# EAGLE design stepper (EAGLE 6.5.0)
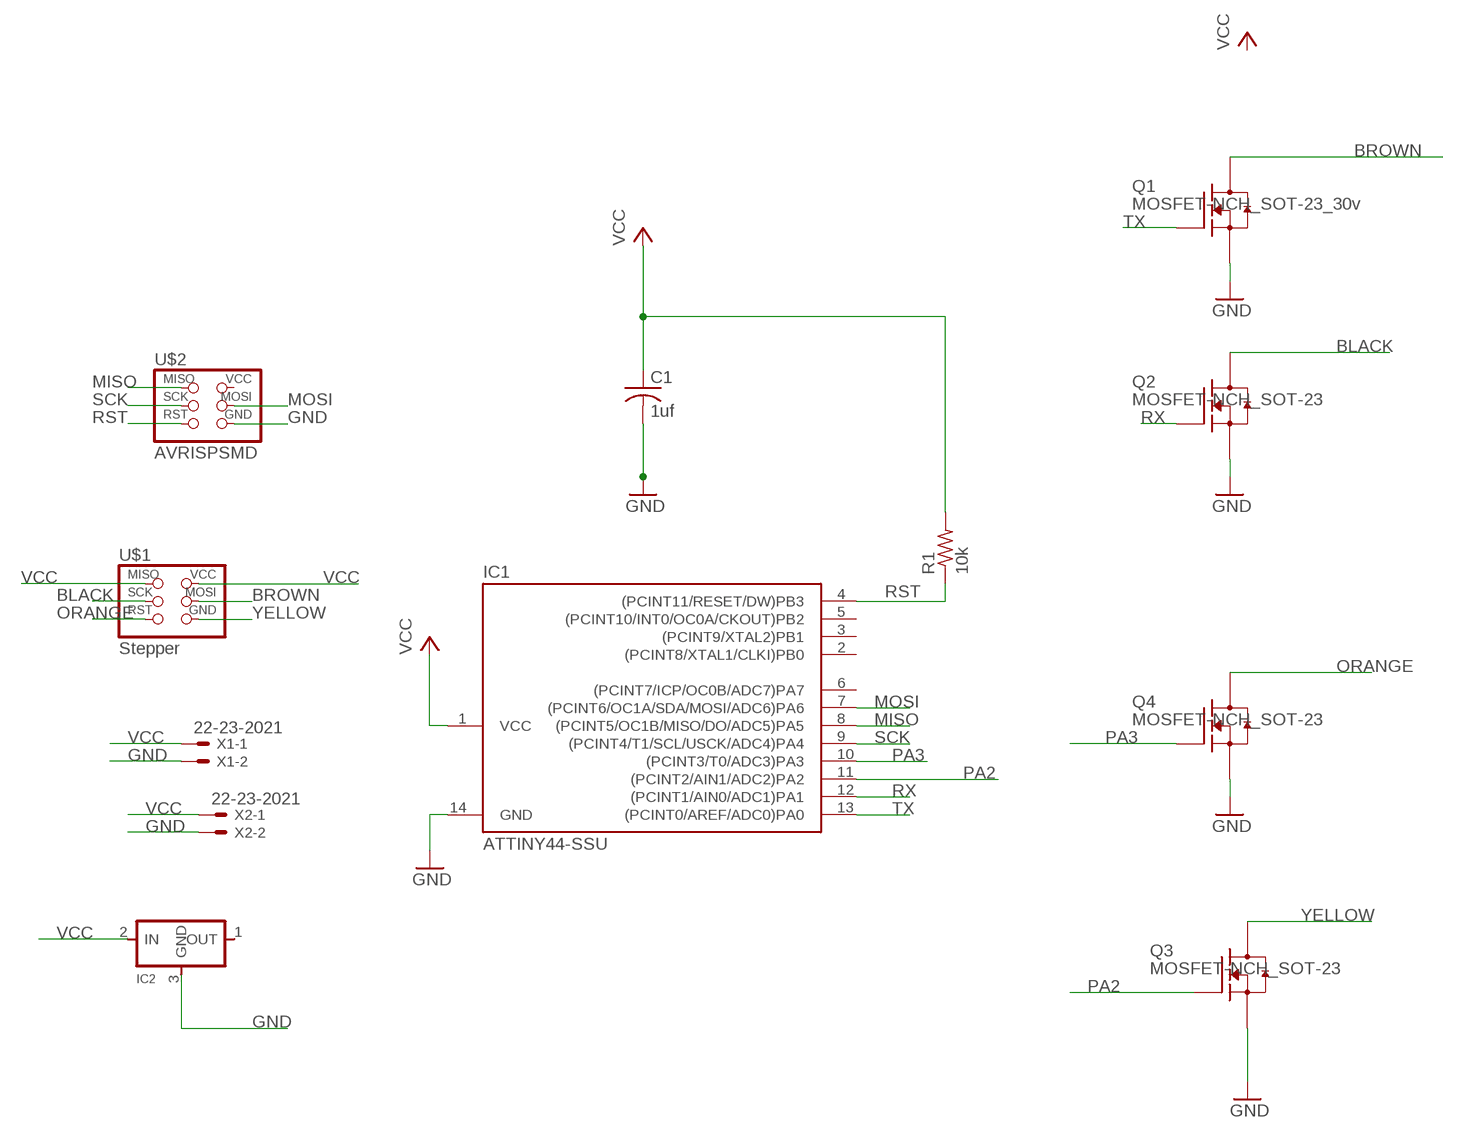
[diagram p0: schematic, sheet 1]

## Parts
C1  1uf  C-USC1206  [C1206]
IC1  ATTINY44-SSU  [SOIC14]
IC2  REGULATORSOT23  [SOT23]
Q1  MOSFET-NCH_SOT-23_30v  MOSFET-NCH_SOT-23  [SOT95P280X135-3N]
Q2  MOSFET-NCH_SOT-23  [SOT95P280X135-3N]
Q3  MOSFET-NCH_SOT-23  [SOT95P280X135-3N]
Q4  MOSFET-NCH_SOT-23  [SOT95P280X135-3N]
R1  10k  R-US_R1206  [R1206]
U$1  Stepper  AVRISPSMD  [2X03SMD]
U$2  AVRISPSMD  [2X03SMD]
X1  22-23-2021  [22-23-2021]
X2  22-23-2021  [22-23-2021]

## Nets
BLACK: Q2.3(D) U$1.3(SCK)
BROWN: Q1.3(D) U$1.4(MOSI)
GND: C1.2 IC1.14(GND) IC2.3(GND) Q1.2(S) Q2.2(S) Q3.2(S) Q4.2(S) U$2.6(GND) X1.2 X2.2
MISO: IC1.8((PCINT5/OC1B/MISO/DO/ADC5)PA5) U$2.1(MISO)
MOSI: IC1.7((PCINT6/OC1A/SDA/MOSI/ADC6)PA6) U$2.4(MOSI)
ORANGE: Q4.3(D) U$1.5(RST)
OUT: C1.1 R1.2 ; supply symbol labelled VCC
PA2: IC1.11((PCINT2/AIN1/ADC2)PA2) Q3.1(G)
PA3: IC1.10((PCINT3/T0/ADC3)PA3) Q4.1(G)
RST: IC1.4((PCINT11/RESET/DW)PB3) R1.1 U$2.5(RST)
RX: IC1.12((PCINT1/AIN0/ADC1)PA1) Q2.1(G)
SCK: IC1.9((PCINT4/T1/SCL/USCK/ADC4)PA4) U$2.3(SCK)
TX: IC1.13((PCINT0/AREF/ADC0)PA0) Q1.1(G)
VCC: IC1.1(VCC) IC2.2(IN) U$1.1(MISO) U$1.2(VCC) X1.1 X2.1
YELLOW: Q3.3(D) U$1.6(GND)
Unconnected: IC1.2((PCINT8/XTAL1/CLKI)PB0) IC1.3((PCINT9/XTAL2)PB1) IC1.5((PCINT10/INT0/OC0A/CKOUT)PB2) IC1.6((PCINT7/ICP/OC0B/ADC7)PA7) IC2.1(OUT) U$2.2(VCC)

## Library data of the parts
C1 = rcl:C-US: CAPACITOR, American symbol
IC1 = fab:ATTINY44
IC2 = ng:REGULATOR
Q1-Q4 = fairchild_ipc-7351-transistor:MOSFET-NCH_
R1 = resistor:R-US_: RESISTOR, American symbol
U$1 U$2 = fab:AVRISP
X1 X2 = con-molex:22-23-2021: .100" (2.54mm) Center Header - 2 Pin; MF: MOLEX; MPN: 22-23-2021; OC_FARNELL: 1462926; OC_NEWARK: 25C3832

## Board
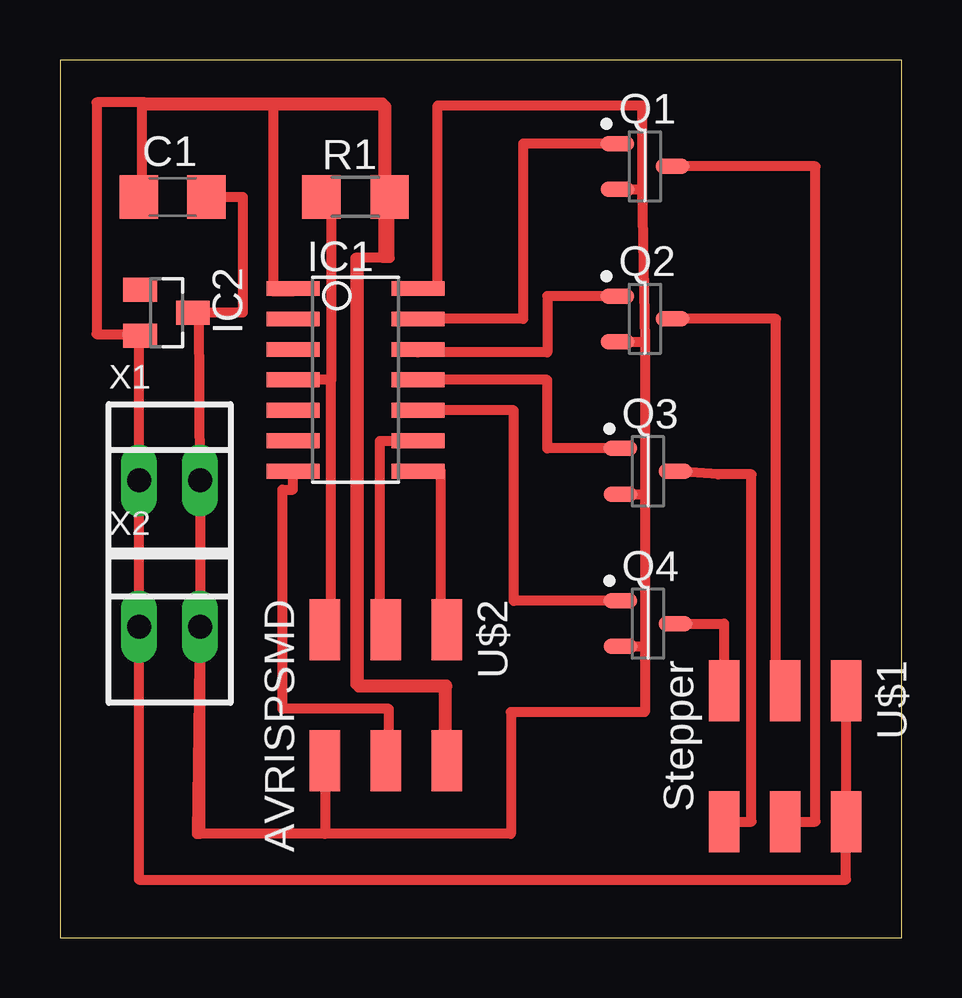
[diagram p1: board, top side]

Size 35.1 x 36.57 mm. Coordinates in mm from the lower left corner, seen from the top.
Outline: 0,0 35.1,0 35.1,36.57 0,36.57 0,0
Copper layers (1*16): Top 0.035mm / dielectric 1.5mm / Bottom 0.035mm
Design rules "default": minimum track width 10mil, minimum drill 24mil, track to track 8mil, track to pad 8mil, pad to pad 8mil, via to via 8mil, smd to smd 8mil, copper to edge 40mil, drill to drill 8mil, minimum pad ring 10mil, minimum via ring 8mil, stop-mask expansion 4mil, vias tented up to drill 0mil, thermal gap 10mil

### Footprints (pad centres in the part's own frame; a part is rotated, then mirrored left to right if it is on the bottom)
C1206 = smd 1.6 x 1.8: 1 -1.4,0; 2 1.4,0
SOIC14 = smd 0.61 x 2.21: 1 -3.81,-2.603; 2 -2.54,-2.603; 3 -1.27,-2.603; 4 0,-2.603; 5 1.27,-2.603; 6 2.54,-2.603; 7 3.81,-2.603; 8 3.81,2.603; 9 2.54,2.603; 10 1.27,2.603; 11 0,2.603; 12 -1.27,2.603; 13 -2.54,2.603; 14 -3.81,2.603
SOT23 = smd 1 x 1.4: 1 -0.95,-1.1; 2 0.95,-1.1; 3 0,1.1
SOT95P280X135-3N = smd 1.4 x 0.65: 1 -1.15,0.95; 2 -1.15,-0.95; 3 1.15,0
R1206 = smd 1.6 x 1.803: 1 -1.422,0; 2 1.422,0
2X03SMD = smd 2.54 x 1.27: 1 -2.54,2.54; 2 2.92,2.54; 3 -2.54,0; 4 2.92,0; 5 -2.54,-2.54; 6 2.92,-2.54
22-23-2021 = drill 1 long: 1 -1.27,0; 2 1.27,0

### Placement (x,y rotation side)
C1  4.7,30.86 0 top
IC1  12.32,23.24 270 top
IC2  4.45,26.04 270 top
Q1  24.38,32.13 0 top
Q2  24.38,25.78 0 top
Q3  24.51,19.43 0 top
Q4  24.51,13.08 0 top
R1  12.32,30.86 0 top
U$1  30.23,7.75 270 top
U$2  13.59,10.29 270 top
X1  4.57,19.05 0 top
X2  4.57,12.95 0 top

### Tracks (layer width: path | path; a pad name or v marks a point on that pad's centre or on a via)
BLACK
  Top 0.406: U$1.3 29.84,9.53 29.84,25.78 Q2.3
BROWN
  Top 0.406: U$1.4 31.5,4.83 31.5,32.13 Q1.3
GND
  Top 0.406: IC1.14 15.75,27.05 15.75,34.67 24.26,34.67 24.26,31.18 | 24.26,31.18 24.38,24.83 | 24.38,24.83 24.38,18.48 | 24.38,18.48 24.38,12.13 | 24.38,12.13 24.38,9.4 18.8,9.4 18.8,4.32 11.05,4.32 | Q1.2 24.26,31.18 | Q2.2 24.38,24.83 | Q4.2 24.38,12.13 | Q3.2 24.38,18.48 | 5.8,26.04 X1.2 5.84,4.32 | U$2.6 11.05,4.32 | 11.05,4.32 5.84,4.32 | 5.84,4.32 5.71,4.32 X2.2 | C1.2 7.62,30.86 7.62,26.04 5.8,26.04 | 5.8,26.04 IC2.3
MISO
  Top 0.406: U$2.1 15.88,13.08 15.88,19.43 IC1.8
MOSI
  Top 0.406: U$2.4 13.72,7.62 13.72,9.53 9.27,9.53 9.27,18.67 9.71,18.67 IC1.7
ORANGE
  Top 0.406: Q4.3 27.69,13.08 U$1.5
OUT
  Top 0.406: 13.59,28.32 13.59,34.67 3.43,34.67 3.43,30.86 C1.1 3.34,30.86 | 13.59,28.32 12.32,28.32 12.32,10.79 | 12.32,10.79 12.32,10.54 16.13,10.54 16.13,10.41 | 16.13,6.73 16.13,10.41 | 16.13,10.41 12.45,10.41 12.45,10.79 12.32,10.79 | 13.59,28.32 13.74,28.32 R1.2
PA2
  Top 0.406: IC1.11 20.32,23.24 20.32,20.38 Q3.1
PA3
  Top 0.406: Q4.1 18.92,14.03 18.92,21.97 IC1.10
RST
  Top 0.406: 11.3,23.24 IC1.4 | U$2.5 11.3,13.08 11.3,23.24 | R1.1 11.3,30.86 11.3,23.24
RX
  Top 0.406: Q2.1 20.32,26.73 20.32,24.38 14.92,24.38 IC1.12
SCK
  Top 0.406: U$2.3 13.34,13.08 13.34,20.7 IC1.9
TX
  Top 0.406: Q1.1 19.3,33.08 19.3,25.78 IC1.13
VCC
  Top 0.406: 32.77,7.11 U$1.1 U$1.2 32.77,2.41 3.3,2.41 X2.1 | X2.1 3.3,25.02 3.34,25.15 | 16,7.62 16,10.54 | 16,10.54 12.45,10.54 | 12.45,10.54 12.32,10.54 12.32,28.32 12.45,28.32 | 13.72,28.32 13.46,28.32 | 3.56,34.8 8.89,34.8 | 8.89,34.8 8.89,26.92 9.71,26.92 IC1.1 | 8.89,34.8 13.46,34.8 13.46,34.67 | 13.46,34.67 13.46,28.32 | 13.46,28.32 12.45,28.32 | 12.45,28.32 12.45,10.54 | 16,10.54 16.13,10.54 16.13,10.41 16,10.41 16,6.48 | X2.1 X1.1 | 13.46,34.67 3.43,34.67 3.56,34.8 | 3.56,34.8 1.52,34.8 1.52,25.15 3.34,25.15 | 3.34,25.15 IC2.2
YELLOW
  Top 0.406: U$1.6 28.83,4.83 28.83,19.3 27.44,19.3 Q3.3